# Altium project FallDetectionBand.PrjPcb
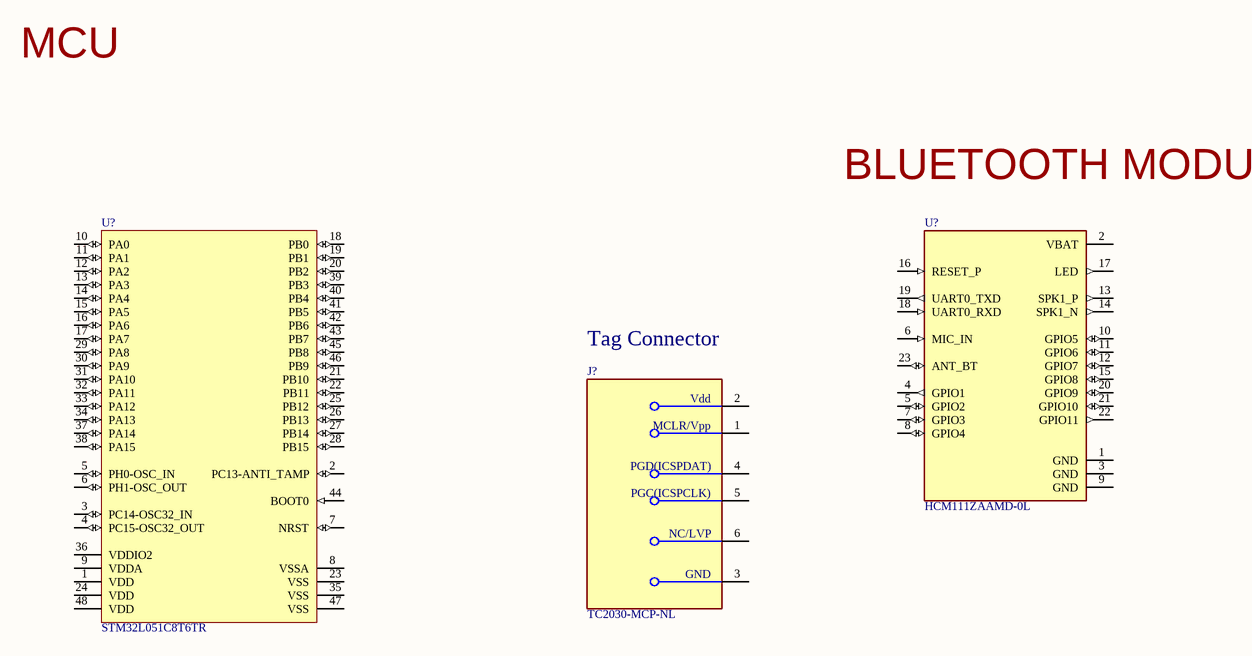
[diagram p0: Main.SchDoc]
3 sheets, 8 parts. Net scope: global (net labels, ports and power ports of the same name join across sheets).
Sheets:
  Main.SchDoc
  Sensors.SchDoc
  Power.SchDoc

## Sheet Main.SchDoc
size A4; SheetNumber: 1; SheetTotal: 3

### Parts
(Parts that share a designator on the sheet are numbered #1, #2 ... from top to bottom, then left to right.)
J?#1  TC2030-MCP-NL  [FP-TC2030-MCP-NL-MFG]
U?#1  STM32L051C8T6TR  [STM-LQFP48_N]
U?#2  HCM111ZAAMD-0L  [XCVR_HCM111ZAAMD-0L]

### Nets

Not connected (* = marked no-connect by the designer): J?#1 1(MCLR/Vpp) 2(Vdd) 3(GND) 4(PGD(ICSPDAT)) 5(PGC(ICSPCLK)) 6(NC/LVP); U?#1 1(VDD) 2(PC13-ANTI_TAMP) 3(PC14-OSC32_IN) 4(PC15-OSC32_OUT) 5(PH0-OSC_IN) 6(PH1-OSC_OUT) 7(NRST) 8(VSSA) 9(VDDA) 10(PA0) 11(PA1) 12(PA2) 13(PA3) 14(PA4) 15(PA5) 16(PA6) 17(PA7) 18(PB0) 19(PB1) 20(PB2) 21(PB10) 22(PB11) 23(VSS) 24(VDD) 25(PB12) 26(PB13) 27(PB14) 28(PB15) 29(PA8) 30(PA9) 31(PA10) 32(PA11) 33(PA12) 34(PA13) 35(VSS) 36(VDDIO2) 37(PA14) 38(PA15) 39(PB3) 40(PB4) 41(PB5) 42(PB6) 43(PB7) 44(BOOT0) 45(PB8) 46(PB9) 47(VSS) 48(VDD); U?#2 1(GND) 2(VBAT) 3(GND) 4(GPIO1) 5(GPIO2) 6(MIC_IN) 7(GPIO3) 8(GPIO4) 9(GND) 10(GPIO5) 11(GPIO6) 12(GPIO7) 13(SPK1_P) 14(SPK1_N) 15(GPIO8) 16(RESET_P) 17(LED) 18(UART0_RXD) 19(UART0_TXD) 20(GPIO9) 21(GPIO10) 22(GPIO11) 23(ANT_BT)

### Notes on the sheet
- MCU
- BLUETOOTH MODULE
- Tag Connector

### Library data of the parts
J?#1 = CMP-205963-000002-1: CABLE TAG-CONNECT IN-CIRCUIT; RoHS Compliant: Yes; Series: -; Reach SVHC Compliant: Yes; Package Quantity: 1; Lead Free: Lead Free
U?#1 = CMP-1546-00004-1: Ultra-Low-Power ARM Cortex-M0+ MCU, 64 KB Flash, 1.8 to 3.6 V, -40 to 85 degC, 48-Pin LQFP, RoHS, Tape and Reel; Flash: 64 KB; VDD Min: 1.8 V; RAM: 8 KB; Data EEPROM: 2 KB; VDD Max: 3.6 V; Temperature Max: 85 degC; PartNumber: STM32L051C8T6TR; ComponentLink1URL: http://www.st.com/web/en/home.html; ComponentLink1Description: Manufacturer URL; PackageDescription: 48-Pin Frame Chip Scale Package, Body 7 x 7 mm, Pitch 0.5 mm; ComponentLink3URL: http://www.st.com/st-web-ui/static/active/en/resource/technical/document/datasheet/DM00058181.pdf; Packing: Tape and Reel; Mounting Technology: Surface Mount; ComponentLink3Description: Package Specification; RoHS: TRUE; ComponentLink2Description: Datasheet; Temperature Min: -40 degC; DatasheetVersion: Rev. 4; ComponentLink2URL: http://www.st.com/st-web-ui/static/active/en/resource/technical/document/datasheet/DM00108219.pdf
U?#2 = HCM111ZAAMD-0L: Package: None; Price: None; Value: *; MP: HCM111ZAAMD-0L; Availability: Unavailable

## Sheet Sensors.SchDoc
size A4; SheetNumber: 2; SheetTotal: 3
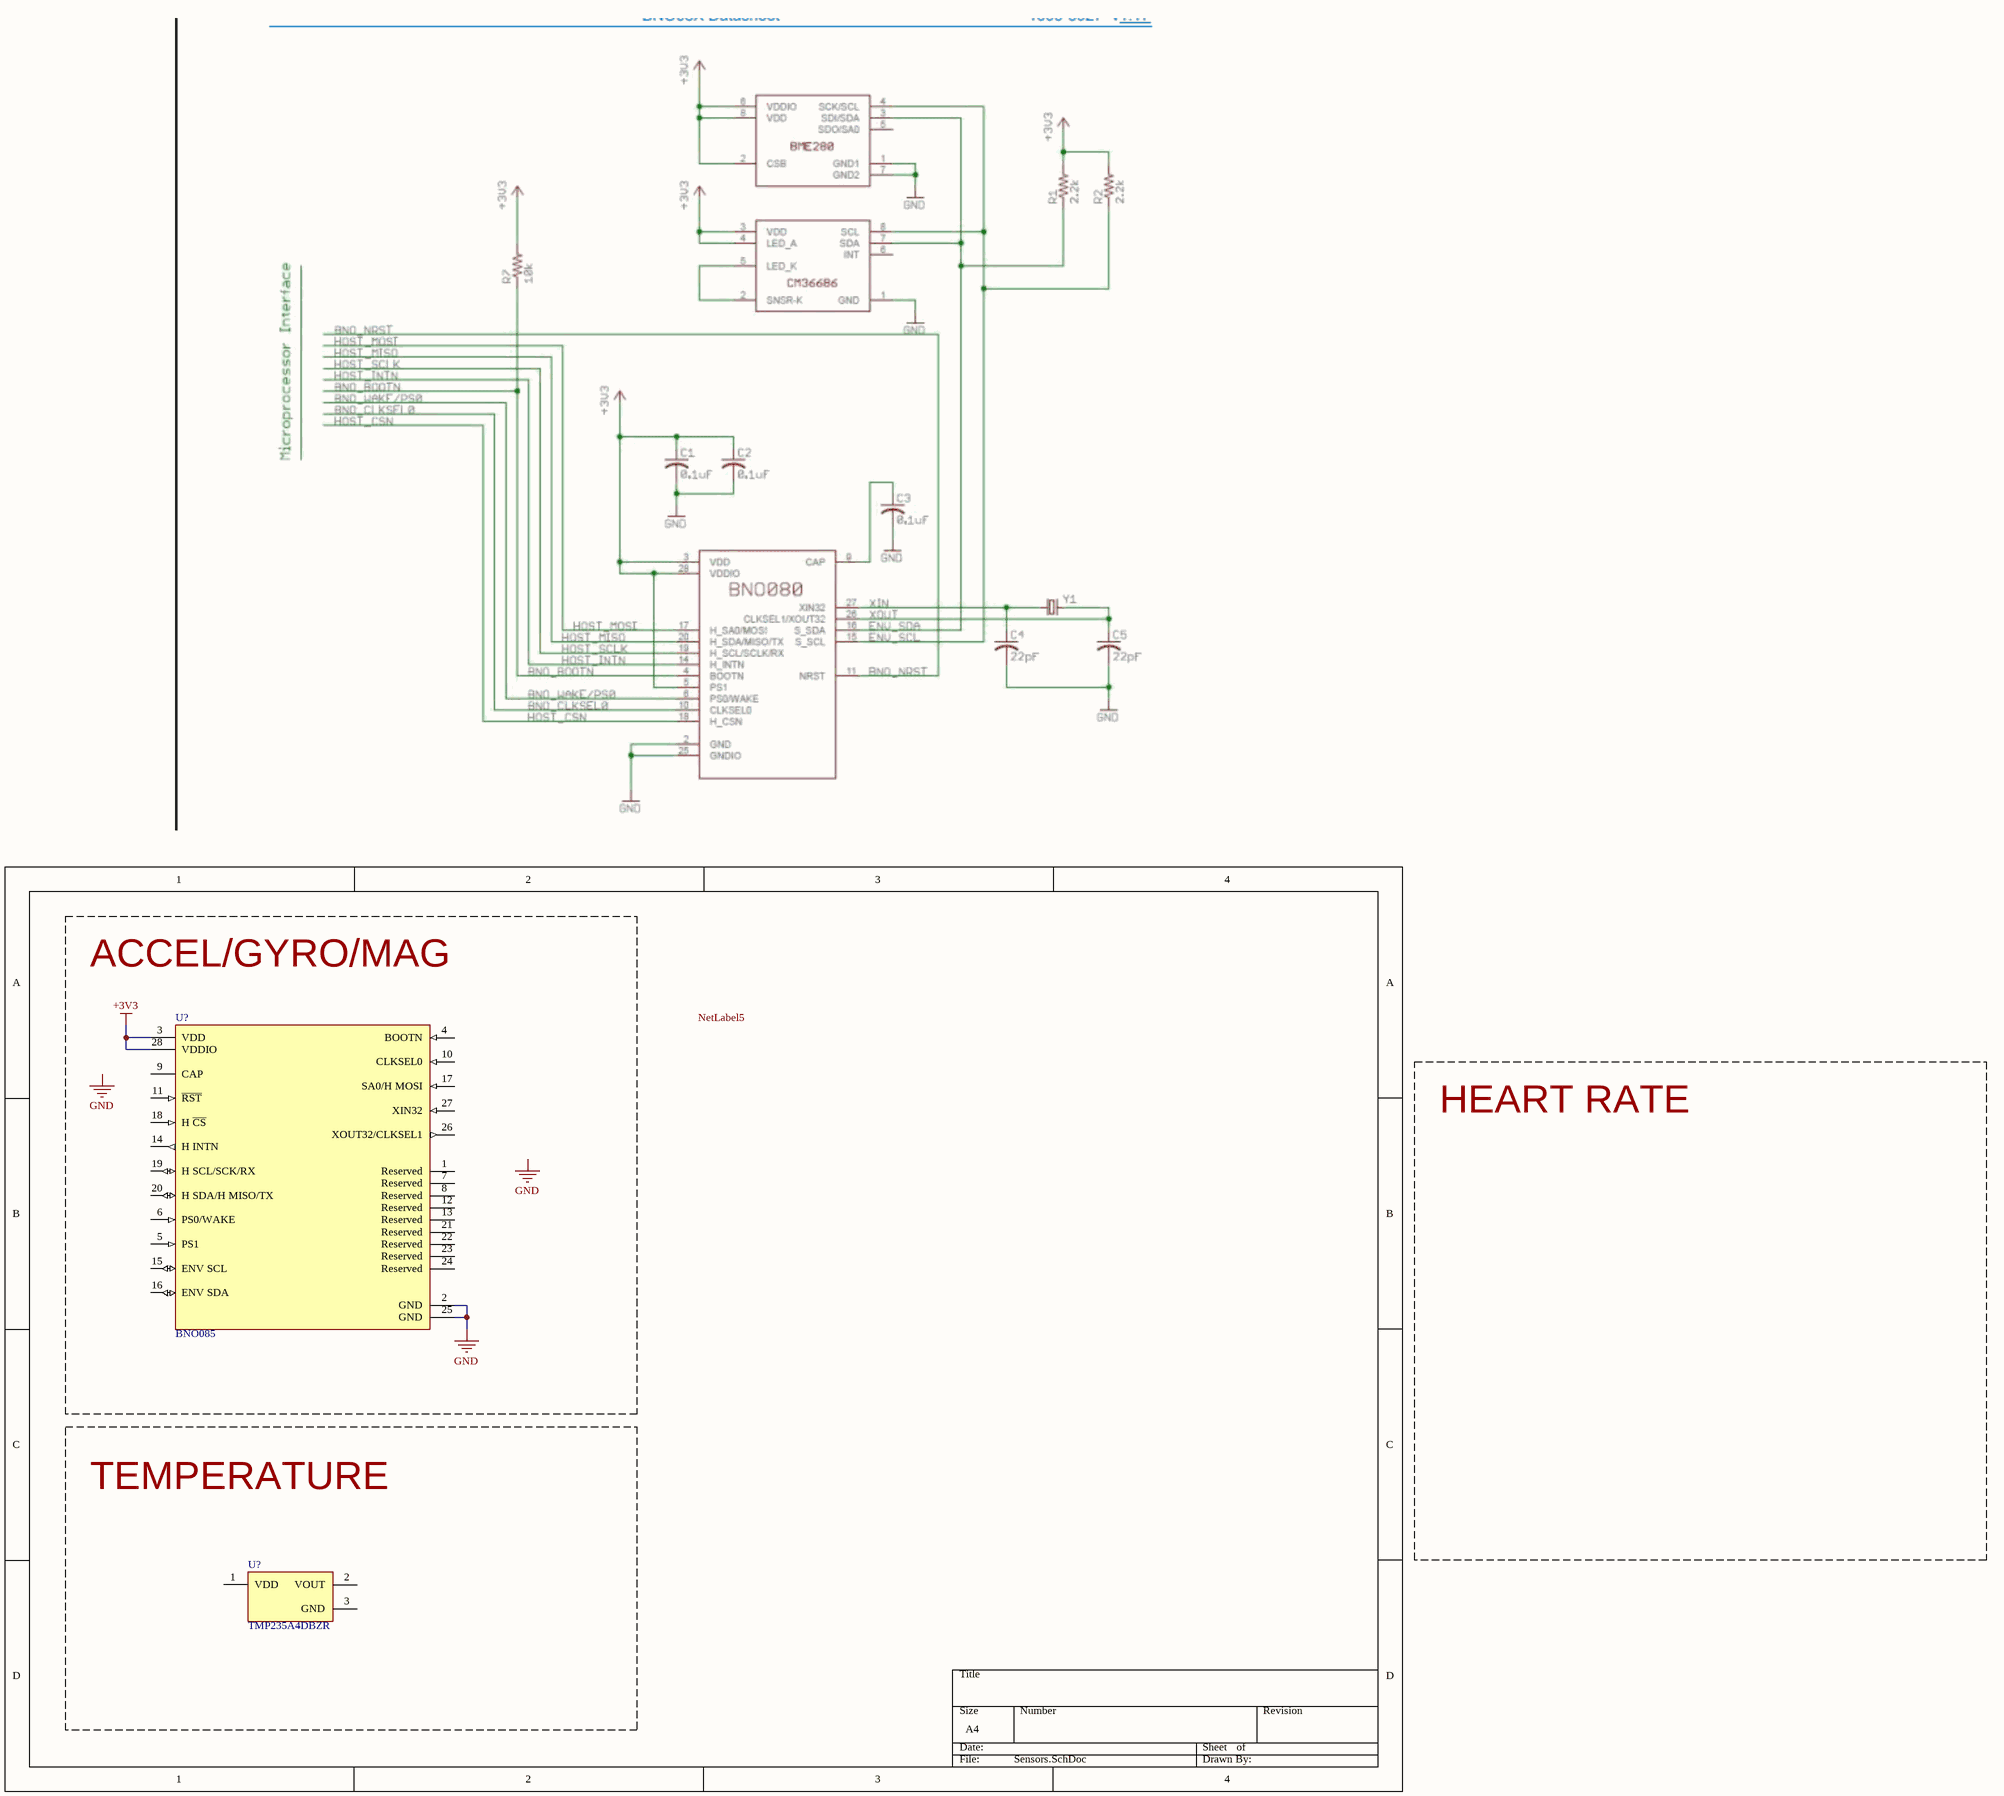
[diagram p1: Sensors.SchDoc]

### Parts
(Parts that share a designator on the sheet are numbered #1, #2 ... from top to bottom, then left to right.)
U?#3  BNO085  [FP-BNO085-MFG]
U?#4  TMP235A4DBZR  [FP-DBZ0003A-MFG]

### Blocks framed on the sheet
ACCEL/GYRO/MAG: U?#3
TEMPERATURE: U?#4

### Nets
+3V3: U?#3.3(VDD) U?#3.28(VDDIO)
GND: U?#3.2(GND) U?#3.25(GND)

Not connected (* = marked no-connect by the designer): U?#3 1(Reserved) 4(BOOTN) 5(PS1) 6(PS0/WAKE) 7(Reserved) 8(Reserved) 9(CAP) 10(CLKSEL0) 11(~{RST}) 12(Reserved) 13(Reserved) 14(H_INTN) 15(ENV_SCL) 16(ENV_SDA) 17(SA0/H_MOSI) 18(H_~{CS}) 19(H_SCL/SCK/RX) 20(H_SDA/H_MISO/TX) 21(Reserved) 22(Reserved) 23(Reserved) 24(Reserved) 26(XOUT32/CLKSEL1) 27(XIN32); U?#4 1(VDD) 2(VOUT) 3(GND)

### Notes on the sheet
- HEART RATE
- Labels drawn without touching a wire or pin: GND, NetLabel5

### Library data of the parts
U?#3 = CMP-197298-000001-1: IMU ACCEL/GYRO/MAG I2C 32BIT; Manufacturer: Hillcrest Laboratories, Inc.; Sensor Type: Accelerometer,Gyroscope,Magnetometer; Max Supply Voltage: 3.6V; Sensor Output: I2C,SPI,UART; Accel Range: 8g; Min Supply Voltage: 1.7V; Temperature Range High: +85°C; ComponentLink2URL: https://www.hillcrestlabs.com/download/5a747b8d566d073a5d000536; Octopart: https://octopart.com/bno085-hillcrest+laboratories-92813482; Height: 1.18mm; Device Class L1: Sensors; Digikey Description: IMU ACCEL/GYRO/MAG I2C 32BIT; Automotive: No; Package: BNO085; Device Class L3: Inertial Measurement Units (IMUs); Temperature: -40°C to +85°C; Category: IC; Device Class L2: Motion Sensors; Lead Free: Yes; Manufacturer Part Number: BNO085; Temperature Range Low: -40°C; RoHS: TRUE; ComponentLink2Description: Datasheet
U?#4 = CMP-04948-000018-1: LOW-POWER HIGH-ACCURACY ANALOG O; Manufacturer: Texas Instruments; Min Supply Voltage: 2.3V; Description: Low-Power, High-Accuracy Analog Output Temperature Sensors; Output Current: 500uA; Operating Supply Current: 9-17uA; Max Supply Voltage: 5.5V; Max Junction Temp: +150°C; Standoff Height: 0.01mm; Sensor Output: Analog Voltage; Temperature Range High: +150°C; Lead Free: Yes; Device Class L1: Sensors; Device Class L3: unset; Automotive: No; ComponentLink2Description: Datasheet; Temperature: -40°C to +150°C; RoHS: TRUE; Manufacturer Part Number: TMP235A4DBZR; Digikey Description: LOW-POWER HIGH-ACCURACY ANALOG O; Ambient Temperature Range High: +150°C; Ambient Temperature Range Low: -40°C; ComponentLink2URL: http://www.ti.com/lit/ds/symlink/tmp235.pdf; Temperature Range Low: -40°C; Device Class L2: Temperature and Humidity Sensors; Category: IC; Mouser Description: ±2.5°C Analog output temperature sensor, with 10mV /°C gain 3-SOT-23 -40 to 150; Height: 1.12mm; Package: DBZ0003A; Octopart: https://octopart.com/tmp235a4dbzr-texas+instruments-94966378

## Sheet Power.SchDoc
size A4; SheetNumber: 3; SheetTotal: 3
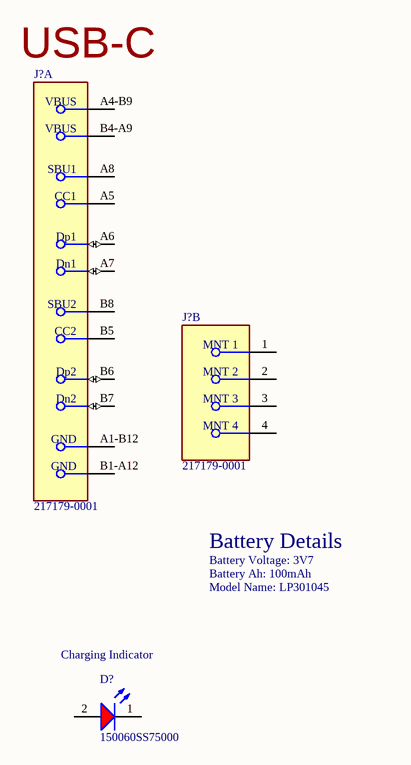
[diagram p2: Power.SchDoc]

### Parts
(Parts that share a designator on the sheet are numbered #1, #2 ... from top to bottom, then left to right.)
D?  150060SS75000  [WL-SMCW_0603_150060xx75000]
J?#2  217179-0001  [FP-2171790001-MFG]  (part A of 2)
J?#3  217179-0001  [FP-2171790001-MFG]  (part B of 2)

### Nets

Not connected (* = marked no-connect by the designer): D? 1(K) 2(A); J?#2 A1-B12(GND) A4-B9(VBUS) A5(CC1) A6(Dp1) A7(Dn1) A8(SBU1) B1-A12(GND) B4-A9(VBUS) B5(CC2) B6(Dp2) B7(Dn2) B8(SBU2); J?#3 1(MNT_1) 2(MNT_2) 3(MNT_3) 4(MNT_4)

### Notes on the sheet
- (near J?#2) USB-C
- Battery Voltage: 3V7
- Battery Ah: 100mAh
- Battery Details
- Model Name: LP301045
- Charging Indicator

### Library data of the parts
D? = CMP-1426-00004-3: Led, Red, 630 Nm, 1.9 V, 30 Ma, 60 Mcd Rohs Compliant: Yes; Dominant Wavelength: 630nm; Lens Style: Clear, Rectangular; Forward Current: 100mA; Test Current: 20mA; Viewing Angle: 140°; Forward Voltage: 1.9V; Peak Wavelength: 645nm; Max Reverse Voltage (DC): 5V; Luminous Intensity: 60mcd; Color: Red; Height: 700µm; Min Operating Temperature: -40°C; Case Code (Imperial): 0603; REACH SVHC: Unknown; RoHS: Compliant; Length: 1.6mm; Case Code (Metric): 1608; Mount: Surface Mount; Wavelength: 630nm; Packaging: Tape and Reel; Max Operating Temperature: 85°C; Width: 800µm; Case/Package: 0603
J?#2 J?#3 = CMP-04767-000028-2: CONN RCP USB2.0 TYP C 24P SMD RA; NexarPartId: 117190526; Gender: Receptacle; Number of Contacts: 16; Current Rating: 1.25A; Voltage Rating: 30V; Min Operating Temperature: -40°C; USB Standard: USB 2.0; Height: 3.36mm; Contact Material: Gold, Nickel; Max Operating Temperature: 85°C